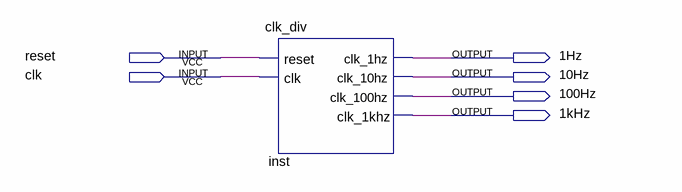
[diagram p0: schematic sheet]
// Quartus schematic counter_top.bdf as structural Verilog: 1 symbols, 6 pins
module counter_top (
  input  reset,
  input  clk,
  output \1Hz ,
  output \10Hz ,
  output \100Hz ,
  output \1kHz 
);

  clk_div inst (.reset(reset), .clk(clk), .clk_1hz(\1Hz ), .clk_10hz(\10Hz ), .clk_100hz(\100Hz ), .clk_1khz(\1kHz ));
endmodule
